# Altium project bch-node_v0.1.PrjPcb (part 2 of 2)
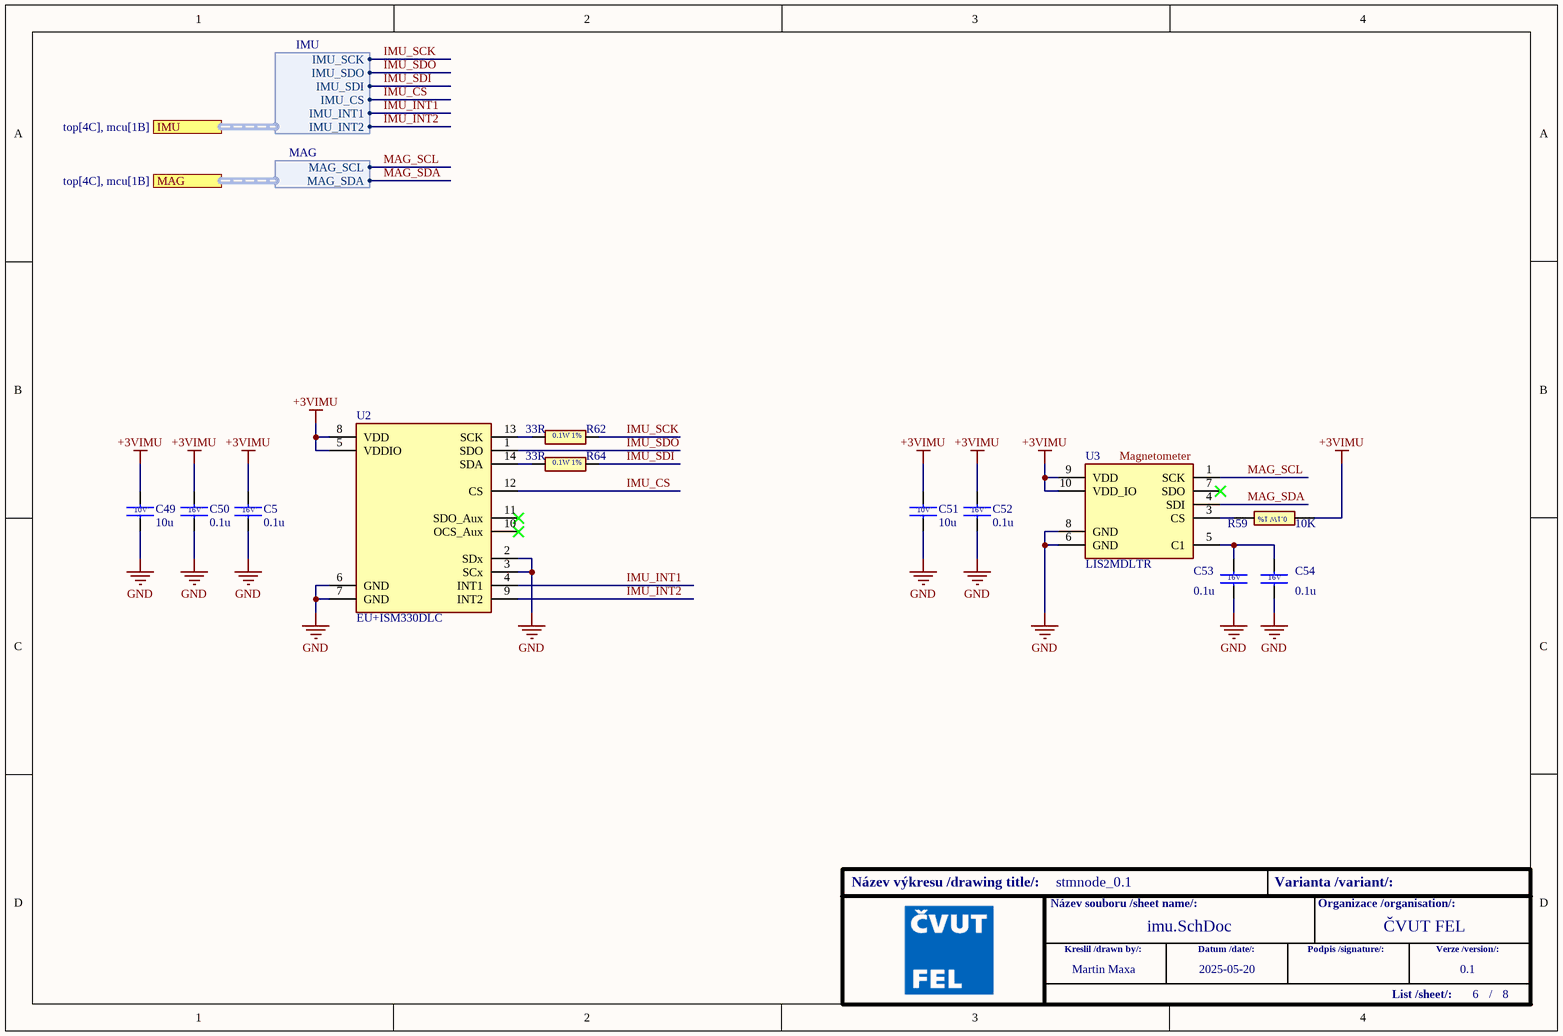
[diagram p6: imu.SchDoc]

## Assembly variants
node: not fitted C8 C35 C36 J2 R1 R20 R33 R?